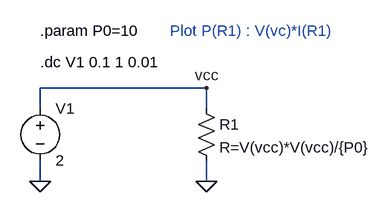
[diagram p0: schematic ConstPower.asc]
ConstPower.asc, the LTspice schematic file:
Version 4
SHEET 1 880 680
WIRE 16 160 16 128
WIRE 16 272 16 240
WIRE 272 128 16 128
WIRE 272 160 272 128
WIRE 272 272 272 240
FLAG 272 272 0
FLAG 16 272 0
FLAG 272 128 vcc
SYMBOL voltage 16 144 R0
SYMATTR InstName V1
SYMATTR Value 2
SYMBOL res 256 144 R0
SYMATTR InstName R1
SYMATTR Value R=V(vcc)*V(vcc)/{P0}
TEXT 16 88 Left 0 !.dc V1 0.1 1 0.01
TEXT 16 40 Left 0 !.param P0=10
TEXT 216 40 Left 0 ;Plot P(R1) : V(vc)*I(R1)

The netlist it stands for:
* ConstPower.asc
V1 vcc 0 2
R1 vcc 0 R=V(vcc)*V(vcc)/{P0}
.dc V1 0.1 1 0.01
.param P0=10
* Plot P(R1) : V(vc)*I(R1)
.backanno
.end